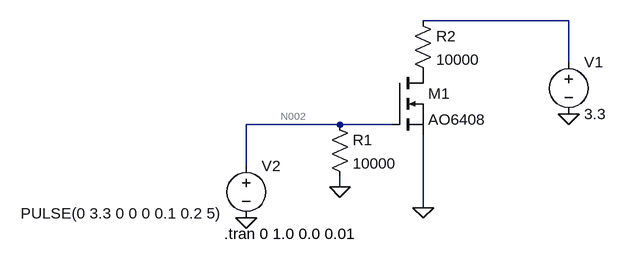
[diagram p0: schematic Draft1.asc]
Draft1.asc, the LTspice schematic file:
Version 4
SHEET 1 912 680
WIRE 416 0 192 0
WIRE 416 64 416 0
WIRE 64 160 -80 160
WIRE 144 160 64 160
WIRE -80 224 -80 160
WIRE 64 256 64 240
WIRE 192 288 192 176
FLAG 64 256 0
FLAG 192 288 0
FLAG 416 144 0
FLAG -80 304 0
SYMBOL voltage 416 48 R0
WINDOW 123 0 0 Left 0
WINDOW 39 0 0 Left 0
SYMATTR InstName V1
SYMATTR Value 3.3
SYMBOL voltage -80 208 R0
WINDOW 3 -347 89 Left 2
WINDOW 123 0 0 Left 0
WINDOW 39 0 0 Left 0
SYMATTR InstName V2
SYMATTR Value PULSE(0 3.3 0 0 0 0.1 0.2 5)
SYMBOL res 48 144 R0
SYMATTR InstName R1
SYMATTR Value 10000
SYMBOL res 176 -16 R0
SYMATTR InstName R2
SYMATTR Value 10000
SYMBOL nmos 144 80 R0
SYMATTR InstName M1
SYMATTR Value AO6408
TEXT -114 328 Left 2 !.tran 0 1.0 0.0 0.01

The netlist it stands for:
* Draft1.asc
V1 N001 0 3.3
V2 N002 0 PULSE(0 3.3 0 0 0 0.1 0.2 5)
R1 N002 0 10000
R2 N001 P001 10000
M1 P001 N002 0 0 AO6408
.model NMOS NMOS
.model PMOS PMOS
.lib standard.mos
.tran 0 1.0 0.0 0.01
.backanno
.end

* Results of the author's LTspice run, read from the files saved beside the schematic
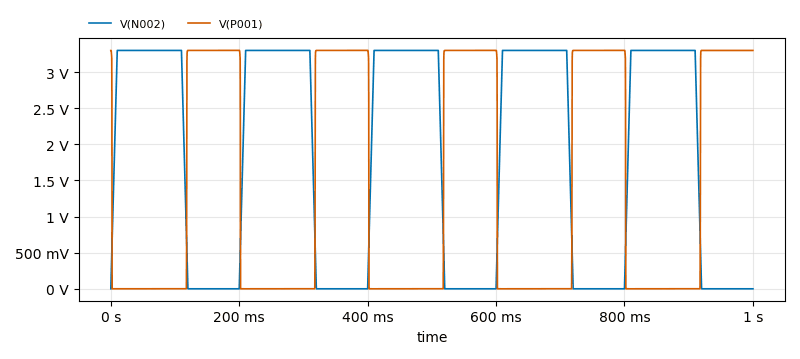
[diagram p1: Transient Analysis of Draft1.asc, plotted from the saved traces]
* Transient Analysis, 1 run:
*   V(N002): min 0 V, max 3.3 V, average 1.815 V, rms 2.415 V, last 0 V
*   V(P001): min 4.366 µV, max 3.301 V, average 1.379 V, rms 2.131 V, last 3.3 V